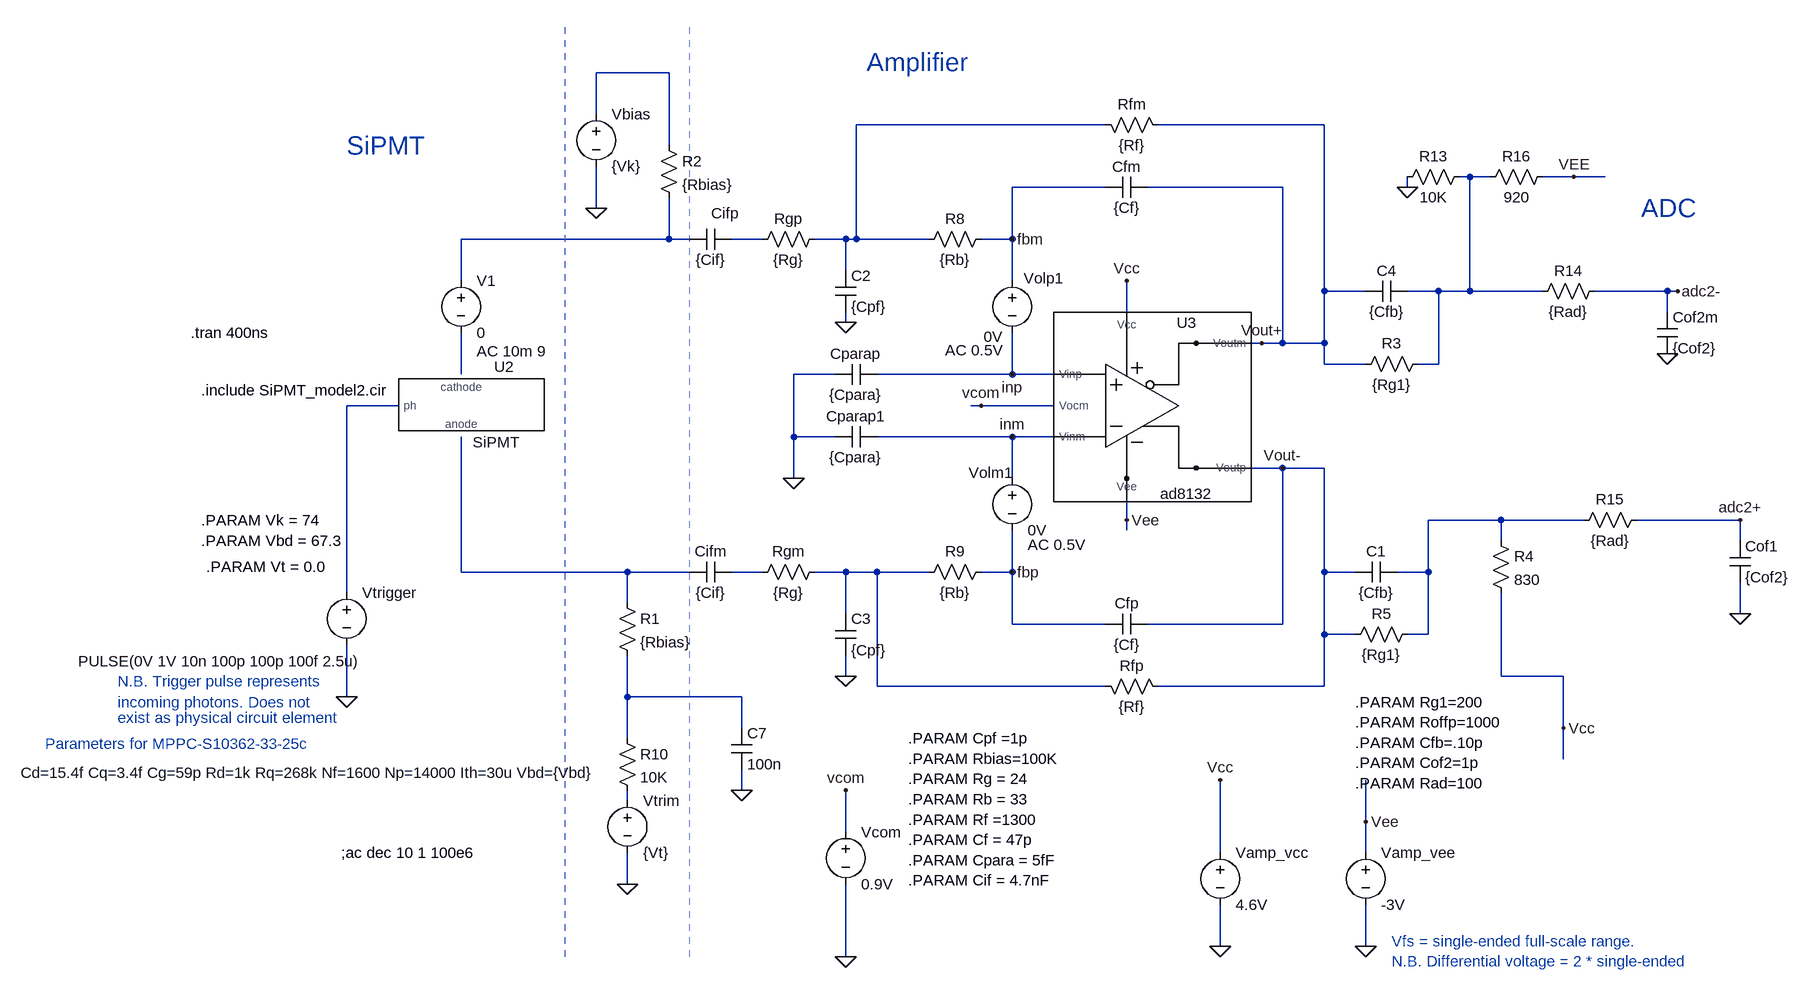
[diagram p0: schematic SiPMT_test_mppc33_ad81322_sa_dualps.asc]
SiPMT_test_mppc33_ad81322_sa_dualps.asc, the LTspice schematic file:
Version 4
SHEET 1 4000 1892
WIRE 1232 96 1120 96
WIRE 1120 160 1120 96
WIRE 1904 176 1520 176
WIRE 2240 176 1984 176
WIRE 1232 208 1232 96
WIRE 2464 256 2448 256
WIRE 2496 256 2464 256
WIRE 2624 256 2576 256
WIRE 2672 256 2624 256
WIRE 1904 272 1760 272
WIRE 2176 272 1968 272
WIRE 2368 272 2368 256
WIRE 1120 304 1120 240
WIRE 1232 352 1232 288
WIRE 1232 352 912 352
WIRE 1264 352 1232 352
WIRE 1376 352 1328 352
WIRE 1504 352 1456 352
WIRE 1520 352 1520 176
WIRE 1520 352 1504 352
WIRE 1632 352 1520 352
WIRE 1760 352 1760 272
WIRE 1760 352 1712 352
WIRE 1504 400 1504 352
WIRE 912 416 912 352
WIRE 1760 416 1760 352
WIRE 2240 432 2240 176
WIRE 2304 432 2240 432
WIRE 2416 432 2368 432
WIRE 2464 432 2464 256
WIRE 2464 432 2416 432
WIRE 2576 432 2464 432
WIRE 2768 432 2656 432
WIRE 2784 432 2768 432
WIRE 1936 464 1936 416
WIRE 2768 464 2768 432
WIRE 1504 480 1504 464
WIRE 2144 512 2128 512
WIRE 2176 512 2176 272
WIRE 2176 512 2144 512
WIRE 2240 512 2240 432
WIRE 2240 512 2176 512
WIRE 2240 544 2240 512
WIRE 2304 544 2240 544
WIRE 2416 544 2416 432
WIRE 2416 544 2384 544
WIRE 912 560 912 496
WIRE 1488 560 1424 560
WIRE 1760 560 1760 496
WIRE 1760 560 1552 560
WIRE 1824 560 1760 560
WIRE 816 608 736 608
WIRE 1712 608 1696 608
WIRE 1824 608 1712 608
WIRE 1424 656 1424 560
WIRE 1488 656 1424 656
WIRE 1760 656 1552 656
WIRE 1824 656 1760 656
WIRE 2176 704 2128 704
WIRE 2240 704 2176 704
WIRE 1424 720 1424 656
WIRE 1760 720 1760 656
WIRE 1936 784 1936 752
WIRE 2512 784 2400 784
WIRE 2640 784 2512 784
WIRE 2880 784 2720 784
WIRE 1936 800 1936 784
WIRE 2512 816 2512 784
WIRE 2880 816 2880 784
WIRE 912 864 912 656
WIRE 1168 864 912 864
WIRE 1264 864 1168 864
WIRE 1376 864 1328 864
WIRE 1504 864 1456 864
WIRE 1552 864 1504 864
WIRE 1632 864 1552 864
WIRE 1760 864 1760 800
WIRE 1760 864 1712 864
WIRE 2240 864 2240 704
WIRE 2288 864 2240 864
WIRE 2400 864 2400 784
WIRE 2400 864 2352 864
WIRE 736 896 736 608
WIRE 1168 912 1168 864
WIRE 1504 928 1504 864
WIRE 2880 928 2880 880
WIRE 1760 944 1760 864
WIRE 1904 944 1760 944
WIRE 2176 944 2176 704
WIRE 2176 944 1968 944
WIRE 2240 960 2240 864
WIRE 2288 960 2240 960
WIRE 2400 960 2400 864
WIRE 2400 960 2368 960
WIRE 1504 1024 1504 992
WIRE 2512 1024 2512 896
WIRE 2608 1024 2512 1024
WIRE 1552 1040 1552 864
WIRE 1904 1040 1552 1040
WIRE 2240 1040 2240 960
WIRE 2240 1040 1984 1040
WIRE 736 1056 736 976
WIRE 1168 1056 1168 992
WIRE 1344 1056 1168 1056
WIRE 1344 1104 1344 1056
WIRE 2608 1104 2608 1024
WIRE 1168 1120 1168 1056
WIRE 2608 1152 2608 1104
WIRE 1344 1200 1344 1168
WIRE 1168 1216 1168 1200
WIRE 2304 1248 2304 1184
WIRE 1504 1264 1504 1200
WIRE 2080 1296 2080 1184
WIRE 2304 1296 2304 1248
WIRE 1168 1344 1168 1296
WIRE 2080 1440 2080 1376
WIRE 2304 1440 2304 1376
WIRE 1504 1456 1504 1344
FLAG 1120 304 0
FLAG 1168 1344 0
FLAG 736 1056 0
FLAG 1936 416 Vcc
FLAG 2080 1440 0
FLAG 2080 1184 Vcc
FLAG 2784 432 adc2-
FLAG 2768 528 0
FLAG 1760 352 fbm
FLAG 1760 560 inp
FLAG 1760 656 inm
FLAG 1760 864 fbp
FLAG 1424 720 0
FLAG 2304 1440 0
FLAG 2304 1248 Vee
FLAG 1936 784 Vee
FLAG 2144 512 Vout+
FLAG 2880 928 0
FLAG 1344 1200 0
FLAG 2176 704 Vout-
FLAG 2880 784 adc2+
FLAG 1504 1456 0
FLAG 1504 1200 vcom
FLAG 1712 608 vcom
FLAG 1504 1024 0
FLAG 1504 480 0
FLAG 2608 1104 Vcc
FLAG 2368 272 0
FLAG 2624 256 VEE
SYMBOL voltage 1120 144 R0
SYMATTR InstName Vbias
SYMATTR Value {Vk}
SYMBOL res 1152 896 R0
SYMATTR InstName R1
SYMATTR Value {Rbias}
SYMBOL voltage 736 880 R0
WINDOW 3 -413 121 Left 2
SYMATTR Value PULSE(0V 1V 10n 100p 100p 100f 2.5u)
SYMATTR InstName Vtrigger
SYMBOL res 1216 192 R0
SYMATTR InstName R2
SYMATTR Value {Rbias}
SYMBOL cap 1264 336 M90
WINDOW 0 -8 54 VBottom 2
WINDOW 3 32 32 VTop 2
SYMATTR InstName Cifp
SYMATTR Value {Cif}
SYMBOL cap 1264 848 M90
WINDOW 0 0 32 VBottom 2
WINDOW 3 32 32 VTop 2
SYMATTR InstName Cifm
SYMATTR Value {Cif}
SYMBOL res 1472 336 R90
WINDOW 0 0 56 VBottom 2
WINDOW 3 32 56 VTop 2
SYMATTR InstName Rgp
SYMATTR Value {Rg}
SYMBOL res 1472 848 R90
WINDOW 0 0 56 VBottom 2
WINDOW 3 32 56 VTop 2
SYMATTR InstName Rgm
SYMATTR Value {Rg}
SYMBOL voltage 2080 1280 R0
WINDOW 123 0 0 Left 2
WINDOW 39 0 0 Left 2
SYMATTR InstName Vamp_vcc
SYMATTR Value 4.6V
SYMBOL res 1888 160 M90
WINDOW 0 0 56 VBottom 2
WINDOW 3 32 56 VTop 2
SYMATTR InstName Rfm
SYMATTR Value {Rf}
SYMBOL cap 1968 256 R90
WINDOW 0 0 32 VBottom 2
WINDOW 3 32 32 VTop 2
SYMATTR InstName Cfm
SYMATTR Value {Cf}
SYMBOL res 1888 1024 M90
WINDOW 0 0 56 VBottom 2
WINDOW 3 32 56 VTop 2
SYMATTR InstName Rfp
SYMATTR Value {Rf}
SYMBOL cap 1968 928 R90
WINDOW 0 0 32 VBottom 2
WINDOW 3 32 32 VTop 2
SYMATTR InstName Cfp
SYMATTR Value {Cf}
SYMBOL cap 2752 464 R0
SYMATTR InstName Cof2m
SYMATTR Value {Cof2}
SYMBOL voltage 1168 1200 R0
SYMATTR InstName Vtrim
SYMATTR Value {Vt}
SYMBOL SiPMT 912 608 R0
WINDOW 39 -230 549 Top 2
SYMATTR SpiceLine Cd=15.4f Cq=3.4f Cg=59p Rd=1k Rq=268k Nf=1600 Np=14000 Ith=30u Vbd={Vbd}
SYMATTR InstName U2
SYMBOL cap 1552 544 R90
WINDOW 0 0 32 VBottom 2
WINDOW 3 32 32 VTop 2
SYMATTR InstName Cparap
SYMATTR Value {Cpara}
SYMBOL cap 1552 640 R90
WINDOW 0 0 32 VBottom 2
WINDOW 3 32 32 VTop 2
SYMATTR InstName Cparap1
SYMATTR Value {Cpara}
SYMBOL ad8132 1952 608 R0
SYMATTR InstName U3
SYMBOL voltage 1760 400 R0
WINDOW 0 18 12 Left 2
WINDOW 3 -44 102 Left 2
WINDOW 123 -103 123 Left 2
SYMATTR InstName Volp1
SYMATTR Value 0V
SYMATTR Value2 AC 0.5V
SYMBOL voltage 1760 704 R0
WINDOW 0 -67 7 Left 2
WINDOW 123 24 118 Left 2
SYMATTR InstName Volm1
SYMATTR Value2 AC 0.5V
SYMATTR Value 0V
SYMBOL voltage 2304 1280 R0
WINDOW 123 0 0 Left 2
WINDOW 39 0 0 Left 2
SYMATTR InstName Vamp_vee
SYMATTR Value -3V
SYMBOL voltage 912 400 R0
WINDOW 123 24 124 Left 2
WINDOW 39 0 0 Left 2
SYMATTR Value2 AC 10m 9
SYMATTR InstName V1
SYMATTR Value 0
SYMBOL cap 2864 816 R0
SYMATTR InstName Cof1
SYMATTR Value {Cof2}
SYMBOL res 1728 336 R90
WINDOW 0 0 56 VBottom 2
WINDOW 3 32 56 VTop 2
SYMATTR InstName R8
SYMATTR Value {Rb}
SYMBOL res 1728 848 R90
WINDOW 0 0 56 VBottom 2
WINDOW 3 32 56 VTop 2
SYMATTR InstName R9
SYMATTR Value {Rb}
SYMBOL cap 1328 1104 R0
SYMATTR InstName C7
SYMATTR Value 100n
SYMBOL res 1152 1104 R0
SYMATTR InstName R10
SYMATTR Value 10K
SYMBOL cap 1488 400 R0
SYMATTR InstName C2
SYMATTR Value {Cpf}
SYMBOL cap 1488 928 R0
SYMATTR InstName C3
SYMATTR Value {Cpf}
SYMBOL res 2400 528 R90
WINDOW 0 0 56 VBottom 2
WINDOW 3 32 56 VTop 2
SYMATTR InstName R3
SYMATTR Value {Rg1}
SYMBOL res 2384 944 R90
WINDOW 0 0 56 VBottom 2
WINDOW 3 32 56 VTop 2
SYMATTR InstName R5
SYMATTR Value {Rg1}
SYMBOL cap 2352 848 R90
WINDOW 0 0 32 VBottom 2
WINDOW 3 32 32 VTop 2
SYMATTR InstName C1
SYMATTR Value {Cfb}
SYMBOL cap 2368 416 R90
WINDOW 0 0 32 VBottom 2
WINDOW 3 32 32 VTop 2
SYMATTR InstName C4
SYMATTR Value {Cfb}
SYMBOL res 2496 800 R0
SYMATTR InstName R4
SYMATTR Value 830
SYMBOL res 2672 416 R90
WINDOW 0 0 56 VBottom 2
WINDOW 3 32 56 VTop 2
SYMATTR InstName R14
SYMATTR Value {Rad}
SYMBOL res 2736 768 R90
WINDOW 0 0 56 VBottom 2
WINDOW 3 32 56 VTop 2
SYMATTR InstName R15
SYMATTR Value {Rad}
SYMBOL res 2464 240 R90
WINDOW 0 0 56 VBottom 2
WINDOW 3 32 56 VTop 2
SYMATTR InstName R13
SYMATTR Value 10K
SYMBOL res 2592 240 R90
WINDOW 0 0 56 VBottom 2
WINDOW 3 32 56 VTop 2
SYMATTR InstName R16
SYMATTR Value 920
SYMBOL voltage 1504 1248 R0
WINDOW 123 0 0 Left 2
WINDOW 39 0 0 Left 2
SYMATTR InstName Vcom
SYMATTR Value 0.9V
TEXT 512 584 Left 2 !.include SiPMT_model2.cir
TEXT 512 784 Left 2 !.PARAM Vk = 74
TEXT 512 816 Left 2 !.PARAM Vbd = 67.3
TEXT 272 1128 Left 2 ;Parameters for MPPC-S10362-33-25c
TEXT 1536 80 Left 4 ;Amplifier
TEXT 2728 304 Left 4 ;ADC
TEXT 736 208 Left 4 ;SiPMT
TEXT 384 1032 Left 2 ;N.B. Trigger pulse represents
TEXT 384 1064 Left 2 ;incoming photons. Does not
TEXT 384 1088 Left 2 ;exist as physical circuit element
TEXT 520 856 Left 2 !.PARAM Vt = 0.0
TEXT 496 496 Left 2 !.tran 400ns
TEXT 2344 1432 Left 2 ;Vfs = single-ended full-scale range. \nN.B. Differential voltage = 2 * single-ended
TEXT 2288 1064 Left 2 !.PARAM Rg1=200\n.PARAM Roffp=1000\n.PARAM Cfb=.10p\n.PARAM Cof2=1p\n.PARAM Rad=100
TEXT 728 1296 Left 2 !;ac dec 10 1 100e6
TEXT 1600 1120 Left 2 !.PARAM Cpf =1p\n.PARAM Rbias=100K\n.PARAM Rg = 24\n.PARAM Rb = 33\n.PARAM Rf =1300\n.PARAM Cf = 47p\n.PARAM Cpara = 5fF\n.PARAM Cif = 4.7nF
LINE Normal 1264 1456 1264 16 2
LINE Normal 1072 1456 1072 16 2

The netlist it stands for:
* SiPMT_test_mppc33_ad81322_sa_dualps.asc
Vbias N001 0 {Vk}
R1 N009 N012 {Rbias}
Vtrigger N007 0 PULSE(0V 1V 10n 100p 100p 100f 2.5u)
R2 N001 N004 {Rbias}
Cifp N004 N005 {Cif}
Cifm N009 N010 {Cif}
Rgp N002 N005 {Rg}
Rgm N011 N010 {Rg}
Vamp_vcc Vcc 0 4.6V
Rfm N002 Vout+ {Rf}
Cfm Vout+ fbm {Cf}
Rfp N011 Vout- {Rf}
Cfp Vout- fbp {Cf}
Cof2m adc2- 0 {Cof2}
Vtrim N013 0 {Vt}
XU2 N009 N006 N007 SiPMT Cd=15.4f Cq=3.4f Cg=59p Rd=1k Rq=268k Nf=1600 Np=14000 Ith=30u Vbd={Vbd}  ; pins anode cathode ph
Cparap inp 0 {Cpara}
Cparap1 inm 0 {Cpara}
XU3 inp inm Vcc Vee Vout+ Vout- vcom ad8132  ; pins Vinp Vinm Vcc Vee Voutm Voutp Vocm
Volp1 fbm inp 0V AC 0.5V
Volm1 inm fbp 0V AC 0.5V
Vamp_vee Vee 0 -3V
V1 N004 N006 0 AC 10m 9
Cof1 adc2+ 0 {Cof2}
R8 fbm N002 {Rb}
R9 fbp N011 {Rb}
C7 N012 0 100n
R10 N012 N013 10K
C2 N002 0 {Cpf}
C3 N011 0 {Cpf}
R3 N003 Vout+ {Rg1}
R5 N008 Vout- {Rg1}
C1 N008 Vout- {Cfb}
C4 N003 Vout+ {Cfb}
R4 N008 Vcc 830
R14 adc2- N003 {Rad}
R15 adc2+ N008 {Rad}
R13 N003 0 10K
R16 Vee N003 920
Vcom vcom 0 0.9V
.include SiPMT_model2.cir
.PARAM Vk = 74
.PARAM Vbd = 67.3
* Parameters for MPPC-S10362-33-25c
* Amplifier
* ADC
* SiPMT
* N.B. Trigger pulse represents
* incoming photons. Does not
* exist as physical circuit element
.PARAM Vt = 0.0
.tran 400ns
* Vfs = single-ended full-scale range.
* N.B. Differential voltage = 2 * single-ended
.PARAM Rg1=200
.PARAM Roffp=1000
.PARAM Cfb=.10p
.PARAM Cof2=1p
.PARAM Rad=100
;ac dec 10 1 100e6
.PARAM Cpf =1p
.PARAM Rbias=100K
.PARAM Rg = 24
.PARAM Rb = 33
.PARAM Rf =1300
.PARAM Cf = 47p
.PARAM Cpara = 5fF
.PARAM Cif = 4.7nF
.lib SiPMT_model2.cir
.lib ./ad8132.cir
.backanno
.end